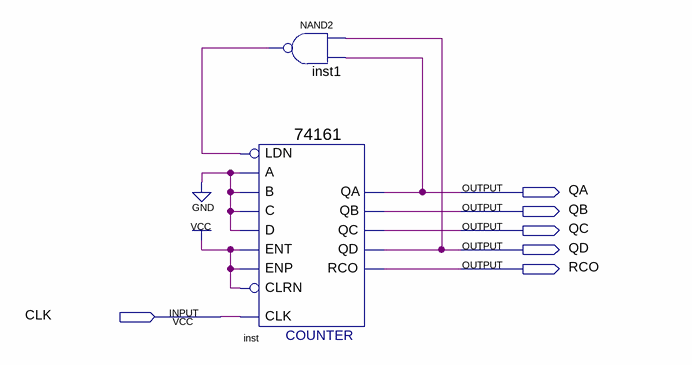
[diagram p0: schematic sheet]
// Quartus schematic Question2p2.bdf as structural Verilog: 2 symbols, 6 pins
module Question2p2 (
  input  CLK,
  output QA,
  output QB,
  output QC,
  output QD,
  output RCO
);

  wire inst1_out;

  nand inst1 (inst1_out, QD, QA);
  \74161  inst (
    .CLRN(1'b1), .CLK(CLK), .ENP(1'b1), .LDN(inst1_out), .A(1'b0), .D(1'b0), .ENT(1'b1), .B(1'b0), .C(1'b0),
    .QD(QD), .QC(QC), .QB(QB), .QA(QA), .RCO(RCO));
endmodule
